# Altium project ghz_sig_gen_base.PrjPcb
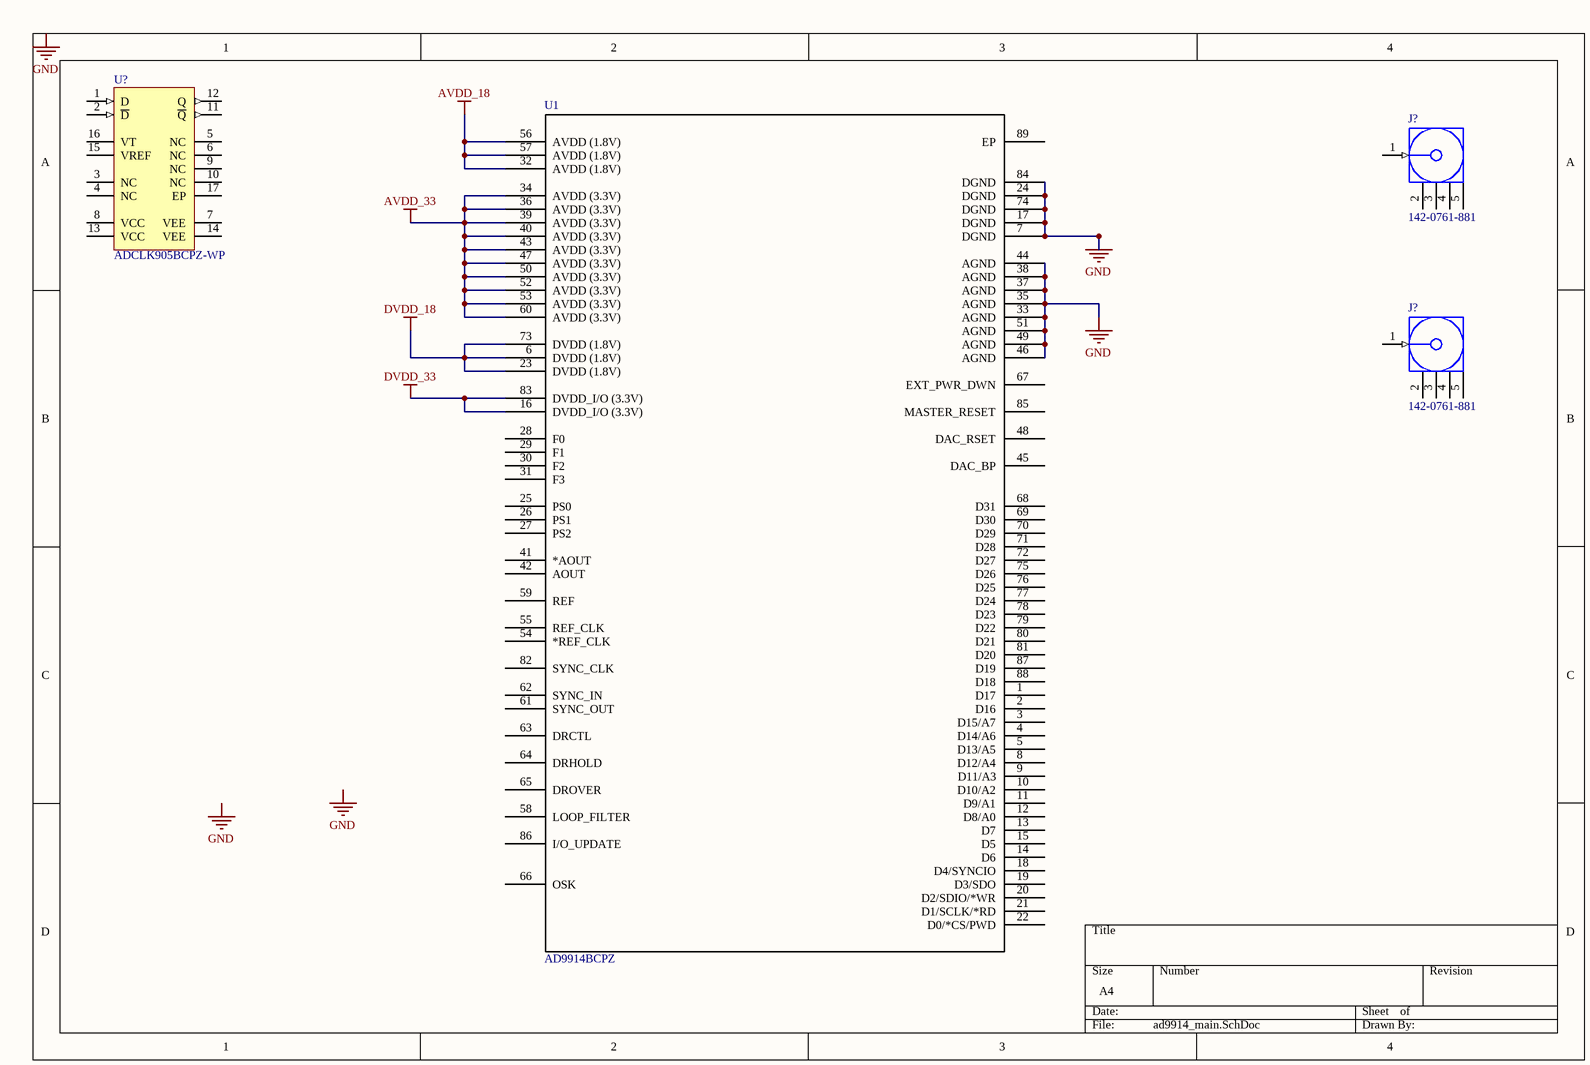
[diagram p0: ad9914_main.SchDoc]
1 sheet, 4 parts. Net scope: global (net labels, ports and power ports of the same name join across sheets).

## Sheet ad9914_main.SchDoc
size A4

### Parts
(Parts that share a designator on the sheet are numbered #1, #2 ... from top to bottom, then left to right.)
J?#1  142-0761-881  [EMSN-142-0761-881-5_V]
J?#2  142-0761-881  [EMSN-142-0761-881-5_V]
U1  AD9914BCPZ  [CP_88_5]
U?  ADCLK905BCPZ-WP  [ADI-CP-16-3_N]

### Nets
AVDD_18: U1.32(AVDD_(1.8V)) U1.56(AVDD_(1.8V)) U1.57(AVDD_(1.8V))
AVDD_33: U1.34(AVDD_(3.3V)) U1.36(AVDD_(3.3V)) U1.39(AVDD_(3.3V)) U1.40(AVDD_(3.3V)) U1.43(AVDD_(3.3V)) U1.47(AVDD_(3.3V)) U1.50(AVDD_(3.3V)) U1.52(AVDD_(3.3V)) U1.53(AVDD_(3.3V)) U1.60(AVDD_(3.3V))
DVDD_18: U1.6(DVDD_(1.8V)) U1.23(DVDD_(1.8V)) U1.73(DVDD_(1.8V))
DVDD_33: U1.16(DVDD_I/O_(3.3V)) U1.83(DVDD_I/O_(3.3V))
GND: U1.7(DGND) U1.17(DGND) U1.24(DGND) U1.33(AGND) U1.35(AGND) U1.37(AGND) U1.38(AGND) U1.44(AGND) U1.46(AGND) U1.49(AGND) U1.51(AGND) U1.74(DGND) U1.84(DGND)

Not connected (* = marked no-connect by the designer): J?#1 1(Signal) 2(GND) 3(GND) 4(GND) 5(GND); J?#2 1(Signal) 2(GND) 3(GND) 4(GND) 5(GND); U1 1(D17) 2(D16) 3(D15/A7) 4(D14/A6) 5(D13/A5) 8(D12/A4) 9(D11/A3) 10(D10/A2) 11(D9/A1) 12(D8/A0) 13(D7) 14(D6) 15(D5) 18(D4/SYNCIO) 19(D3/SDO) 20(D2/SDIO/*WR) 21(D1/SCLK/*RD) 22(D0/*CS/PWD) 25(PS0) 26(PS1) 27(PS2) 28(F0) 29(F1) 30(F2) 31(F3) 41(*AOUT) 42(AOUT) 45(DAC_BP) 48(DAC_RSET) 54(*REF_CLK) 55(REF_CLK) 58(LOOP_FILTER) 59(REF) 61(SYNC_OUT) 62(SYNC_IN) 63(DRCTL) 64(DRHOLD) 65(DROVER) 66(OSK) 67(EXT_PWR_DWN) 68(D31) 69(D30) 70(D29) 71(D28) 72(D27) 75(D26) 76(D25) 77(D24) 78(D23) 79(D22) 80(D21) 81(D20) 82(SYNC_CLK) 85(MASTER_RESET) 86(I/O_UPDATE) 87(D19) 88(D18) 89(EP); U? 1(D) 2(~{D}) 3(NC) 4(NC) 5(NC) 6(NC) 7(VEE) 8(VCC) 9(NC) 10(NC) 11(~{Q}) 12(Q) 13(VCC) 14(VEE) 15(VREF) 16(VT) 17(EP)

### Notes on the sheet
- Labels drawn without touching a wire or pin: GND

### Library data of the parts
J?#1 J?#2 = CMP-00000-A.1: SMA High Freq End Launch Jack Receptacle, PCB Mount, 10 MIL Pin, 26.5 GHz, 50 Ohm, -65 to 165 degC, Round Body Radius 6.27 mm, Body Length 9.52 mm, RoHS; Manufacturer: Emerson Network Power; Body Meaterial: Brass; Impedance: 50 Ohm; Body Plating: Gold; DatasheetVersion: Rev. 0; ComponentLink3URL: https://emersonconnectivity.com/OA_MEDIA/drawings/dr-142-0761-881.pdf; Operating Temperature: -65 to 165 degC; RoHS: TRUE; ComponentLink1URL: https://emersonconnectivity.com/; Mounting Technology: Through Hole; PackageVersion: Rev. 0; PartNumber: 142-0761-881; Termination Type: Solder; Termination Style: Printed Circuit Board; PackageDescription: Jack Receptacle - PC Mount, Body Radius 6.27 mm, Body Length 9.52 mm; Mouting Style: End Launch; PackageReference: 142-0761-881-5; Gender: Jack; Max Frequency: 26.5 GHz; ComponentLink2URL: http://emersonconnectivity.com/OA_MEDIA/drawings/dr-142-0761-881.pdf; ComponentLink3Description: Package Specification; ComponentLink2Description: Datasheet; ComponentLink1Description: Manufacturer URL; Contact Plating: Gold; Series: SMA HF
U1 = AD9914BCPZ: Imported; RefDes: RefDes; Type: DEV; Value: Value
U? = CMP-00001-A.1: Ultrafast SiGe ECL Clock/Data Buffers, CP-16-3, Pb-Free, 50 Tray; Outputs: 1; Product Description: Clock Buffer; +Supply Voltage (V): 3.3; Max f-out (MHz): 6000; On-Chip VCO or DCO: No; Output Logic: ECL; LVPECL; PECL; PackageReference: CP-16-3; ComponentLink2URL: http://www.analog.com/static/imported-files/data_sheets/ADCLK905_907_925.pdf; ComponentLink3Description: Package Specification; PackageVersion: Jan-2005; ComponentLink3URL: http://www.analog.com/static/imported-files/packages/PKG_PDF/LFCSP(CP)/CP_16_3.pdf; DatasheetVersion: Rev. 0; ComponentLink1URL: www.analog.com; PackageDescription: 16-Lead Lead Frame Chip Scale Package [LFCSP_VQ]; ComponentLink1Description: Manufacturer URL; ComponentLink2Description: Datasheet; Inputs: 1; Code_JEDEC: MO-220-VEED-2